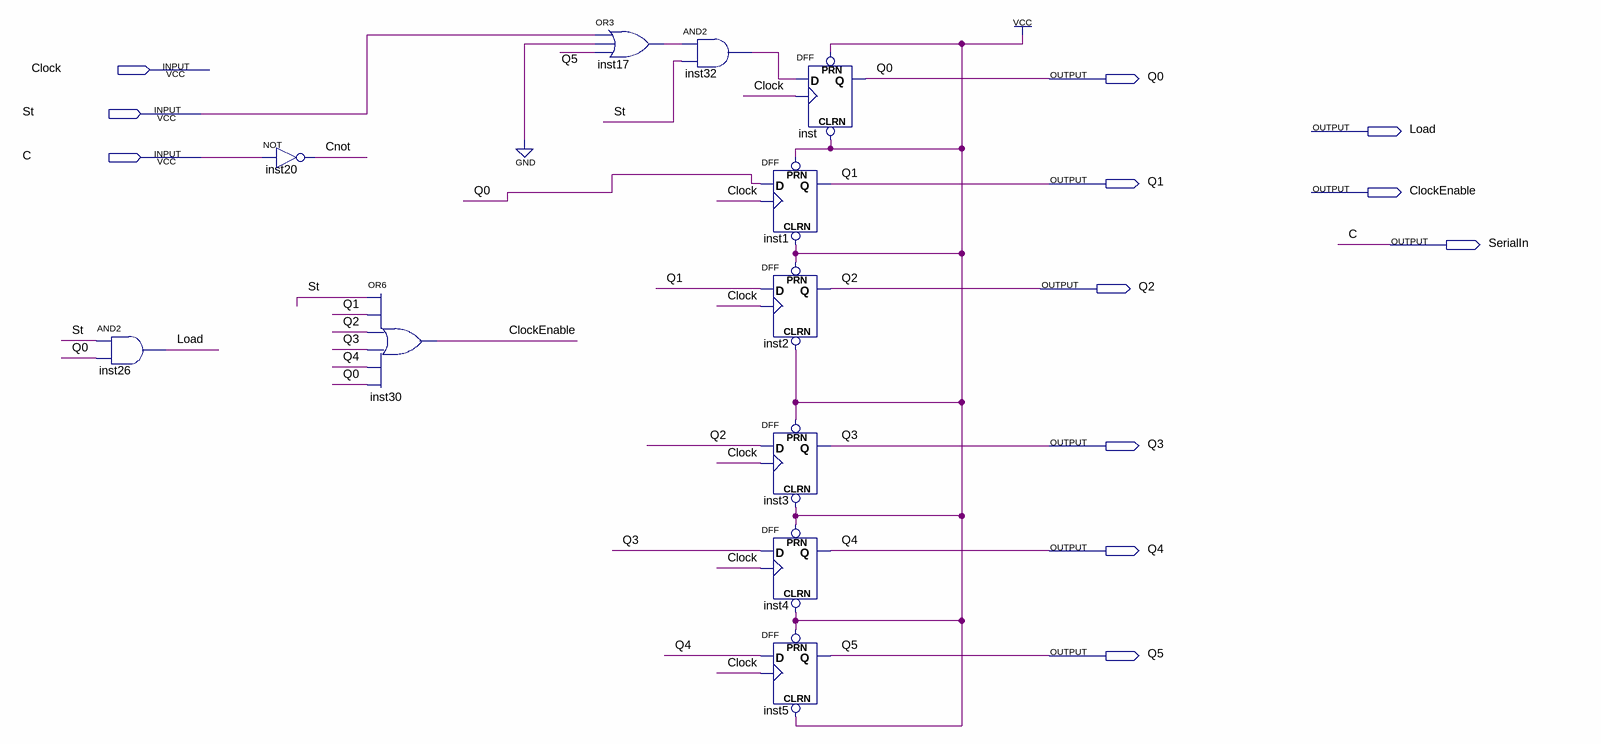
[diagram p0: schematic sheet]
// Quartus schematic Control.bdf as structural Verilog: 11 symbols, 12 pins
module Control (
  input  Clock,
  input  St,
  input  C,
  output Q0,
  output Load,
  output Q1,
  output ClockEnable,
  output SerialIn,
  output Q2,
  output Q3,
  output Q4,
  output Q5
);

  wire Cnot, inst17_out, inst32_out;

  and inst26 (Load, St, Q0);
  not inst20 (Cnot, C);
  or inst30 (ClockEnable, St, Q1, Q2, Q3, Q4, Q0);
  or inst17 (inst17_out, St, 1'b0, Q5);
  and inst32 (inst32_out, inst17_out, St);
  DFF inst1 (.CLRN(1'b1), .CLK(Clock), .D(Q0), .PRN(1'b1), .Q(Q1));
  DFF inst2 (.CLRN(1'b1), .CLK(Clock), .D(Q1), .PRN(1'b1), .Q(Q2));
  DFF inst3 (.CLRN(1'b1), .CLK(Clock), .D(Q2), .PRN(1'b1), .Q(Q3));
  DFF inst4 (.CLRN(1'b1), .CLK(Clock), .D(Q3), .PRN(1'b1), .Q(Q4));
  DFF inst5 (.CLRN(1'b1), .CLK(Clock), .D(Q4), .PRN(1'b1), .Q(Q5));
  DFF inst (.CLRN(1'b1), .CLK(Clock), .D(inst32_out), .PRN(1'b1), .Q(Q0));

  assign SerialIn = C;
endmodule
